# Altium schematic sheet INPUT.SchDoc
size A4; SheetNumber: 4; SheetTotal: 6
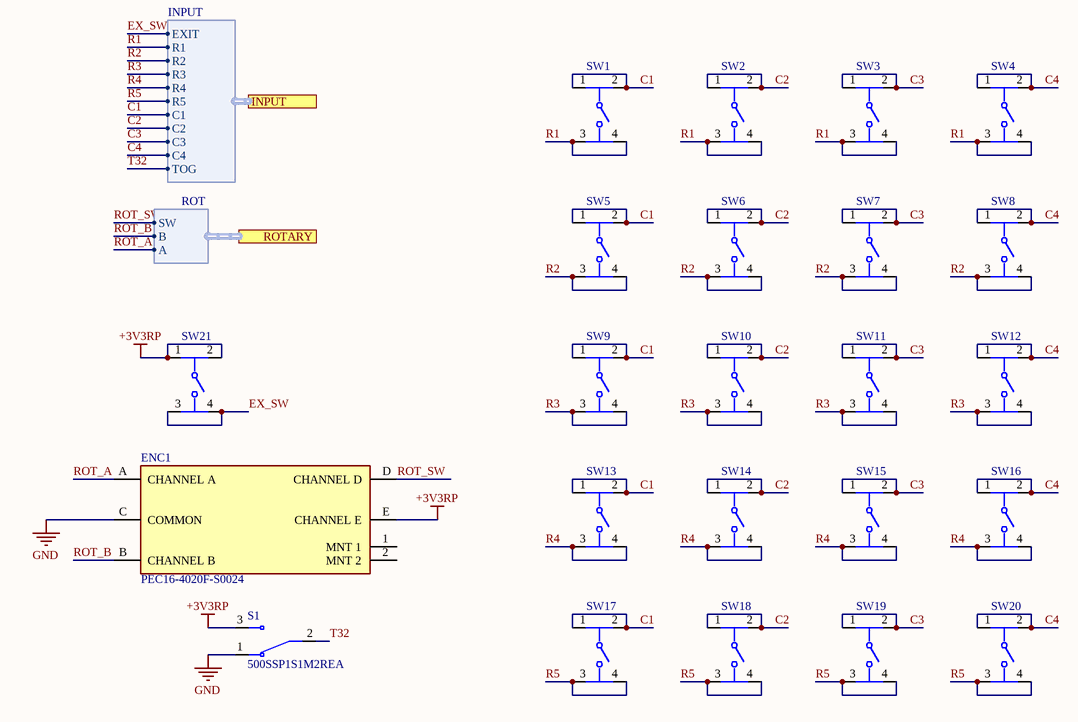
[diagram p0: INPUT.SchDoc]

## Parts
ENC1  PEC16-4020F-S0024  [FP-PEC16-4020F-S0024-MFG]
S1  500SSP1S1M2REA  [SW_500SSP1S1M2REA]
SW1  MJTP1212A  [FP-MJTP1212A-MFG]  (value not drawn)
SW2  MJTP1212A  [FP-MJTP1212A-MFG]  (value not drawn)
SW3  MJTP1212A  [FP-MJTP1212A-MFG]  (value not drawn)
SW4  MJTP1212A  [FP-MJTP1212A-MFG]  (value not drawn)
SW5  MJTP1212A  [FP-MJTP1212A-MFG]  (value not drawn)
SW6  MJTP1212A  [FP-MJTP1212A-MFG]  (value not drawn)
SW7  MJTP1212A  [FP-MJTP1212A-MFG]  (value not drawn)
SW8  MJTP1212A  [FP-MJTP1212A-MFG]  (value not drawn)
SW9  MJTP1212A  [FP-MJTP1212A-MFG]  (value not drawn)
SW10  MJTP1212A  [FP-MJTP1212A-MFG]  (value not drawn)
SW11  MJTP1212A  [FP-MJTP1212A-MFG]  (value not drawn)
SW12  MJTP1212A  [FP-MJTP1212A-MFG]  (value not drawn)
SW13  MJTP1212A  [FP-MJTP1212A-MFG]  (value not drawn)
SW14  MJTP1212A  [FP-MJTP1212A-MFG]  (value not drawn)
SW15  MJTP1212A  [FP-MJTP1212A-MFG]  (value not drawn)
SW16  MJTP1212A  [FP-MJTP1212A-MFG]  (value not drawn)
SW17  MJTP1212A  [FP-MJTP1212A-MFG]  (value not drawn)
SW18  MJTP1212A  [FP-MJTP1212A-MFG]  (value not drawn)
SW19  MJTP1212A  [FP-MJTP1212A-MFG]  (value not drawn)
SW20  MJTP1212A  [FP-MJTP1212A-MFG]  (value not drawn)
SW21  MJTP1212A  [FP-MJTP1212A-MFG]  (value not drawn)

## Ports
INPUT (harness INPUT, see Main[3C], MCU[3B]), ROTARY (harness ROT, see Main[3C], MCU[1B])

## Harnesses
INPUT: EXIT, R1, R2, R3, R4, R5, C1, C2, C3, C4, TOG
ROT: A, B, SW

## Nets
+3V3RP: ENC1.E(CHANNEL_E) S1.3(NO) SW21.1 SW21.2
GND: ENC1.C(COMMON) S1.1(NC)
C1: SW1.1 SW1.2 SW5.1 SW5.2 SW9.1 SW9.2 SW13.1 SW13.2 SW17.1 SW17.2 ; port INPUT.C1
C2: SW2.1 SW2.2 SW6.1 SW6.2 SW10.1 SW10.2 SW14.1 SW14.2 SW18.1 SW18.2 ; port INPUT.C2
C3: SW3.1 SW3.2 SW7.1 SW7.2 SW11.1 SW11.2 SW15.1 SW15.2 SW19.1 SW19.2 ; port INPUT.C3
C4: SW4.1 SW4.2 SW8.1 SW8.2 SW12.1 SW12.2 SW16.1 SW16.2 SW20.1 SW20.2 ; port INPUT.C4
EX_SW: SW21.3 SW21.4 ; port INPUT.EXIT
R1: SW1.3 SW1.4 SW2.3 SW2.4 SW3.3 SW3.4 SW4.3 SW4.4 ; port INPUT.R1
R2: SW5.3 SW5.4 SW6.3 SW6.4 SW7.3 SW7.4 SW8.3 SW8.4 ; port INPUT.R2
R3: SW9.3 SW9.4 SW10.3 SW10.4 SW11.3 SW11.4 SW12.3 SW12.4 ; port INPUT.R3
R4: SW13.3 SW13.4 SW14.3 SW14.4 SW15.3 SW15.4 SW16.3 SW16.4 ; port INPUT.R4
R5: SW17.3 SW17.4 SW18.3 SW18.4 SW19.3 SW19.4 SW20.3 SW20.4 ; port INPUT.R5
ROT_A: ENC1.A(CHANNEL_A) ; port ROTARY.A
ROT_B: ENC1.B(CHANNEL_B) ; port ROTARY.B
ROT_SW: ENC1.D(CHANNEL_D) ; port ROTARY.SW
T32: S1.2(COM) ; port INPUT.TOG

Not connected (* = marked no-connect by the designer): ENC1 1(MNT_1) 2(MNT_2)

## Library data of the parts
ENC1 = CMP-07421-000008-1: ROTARY ENCODER MECHANICAL 24PPR; Number of Channels: 2; Pulses per Revolution: 24; Detent: No; Built in Switch: Yes; Output Type: Quadrature; Contact Plating: Tin; Termination: PC Pin; Encoder Type: Mechanical; Package Quantity: 50; Series: PEC16; Min Operating Temperature: -30°C; RoHS Compliant: Yes; Packaging: Bulk; Type: Mechanical; Length: 28mm; Orientation: Vertical; Mount: Through Hole; Max Operating Temperature: 70°C
S1 = 500SSP1S1M2REA: Slide Switch SPDT Through Hole  <a href="https://pricing.snapeda.com/parts/500SSP1S1M2REA/E-Switch/view-part?ref=eda">Check availability</a> <a href="https://pricing.snapeda.com/parts/500SSP1S1M2REA/E-Switch/view-part?ref=eda">Check availability</a>; Value: *; MP: 500SSP1S1M2REA; Availability: Unavailable; Package: None; Price: None
SW1-SW21 = CMP-47024-000003-1: SWITCH TACTILE SPST-NO 0.05A 12V; Contact Resistance: 100mR; Operating Force: 160gf; Mechanical Life: 100000Cycles; Actuator Length: 3.5mm; Throw Configuration: SPST; Illumination Type: Non-Illuminated; Actuator Material: Polyoxymethylene; Actuator Type: Standard; Switch Travel: 0.3mm; Current Rating: 50mA; Switch Function: Off-Mom; Mount: Through Hole; Contact Plating: Silver; Max Voltage Rating (DC): 12V; Package Quantity: 100; Max Operating Temperature: 70°C; Packaging: Bulk; Voltage Rating (DC): 12V; Termination: PC Pin; Contact Material: Bronze; Orientation: Straight; Min Operating Temperature: -20°C; REACH SVHC: No SVHC; Electrical Life: 100000Cycles